# Altium schematic sheet DSO_Trig.SchDoc: Schematic_Name
size A4; CompanyName: University of Melbourne; Engineer: Your Name Here; DocumentNumber: 1; Revision: 0.1; SheetNumber: 1; SheetTotal: 1; Title_Project: Project_Title; StudentNo: Student No.
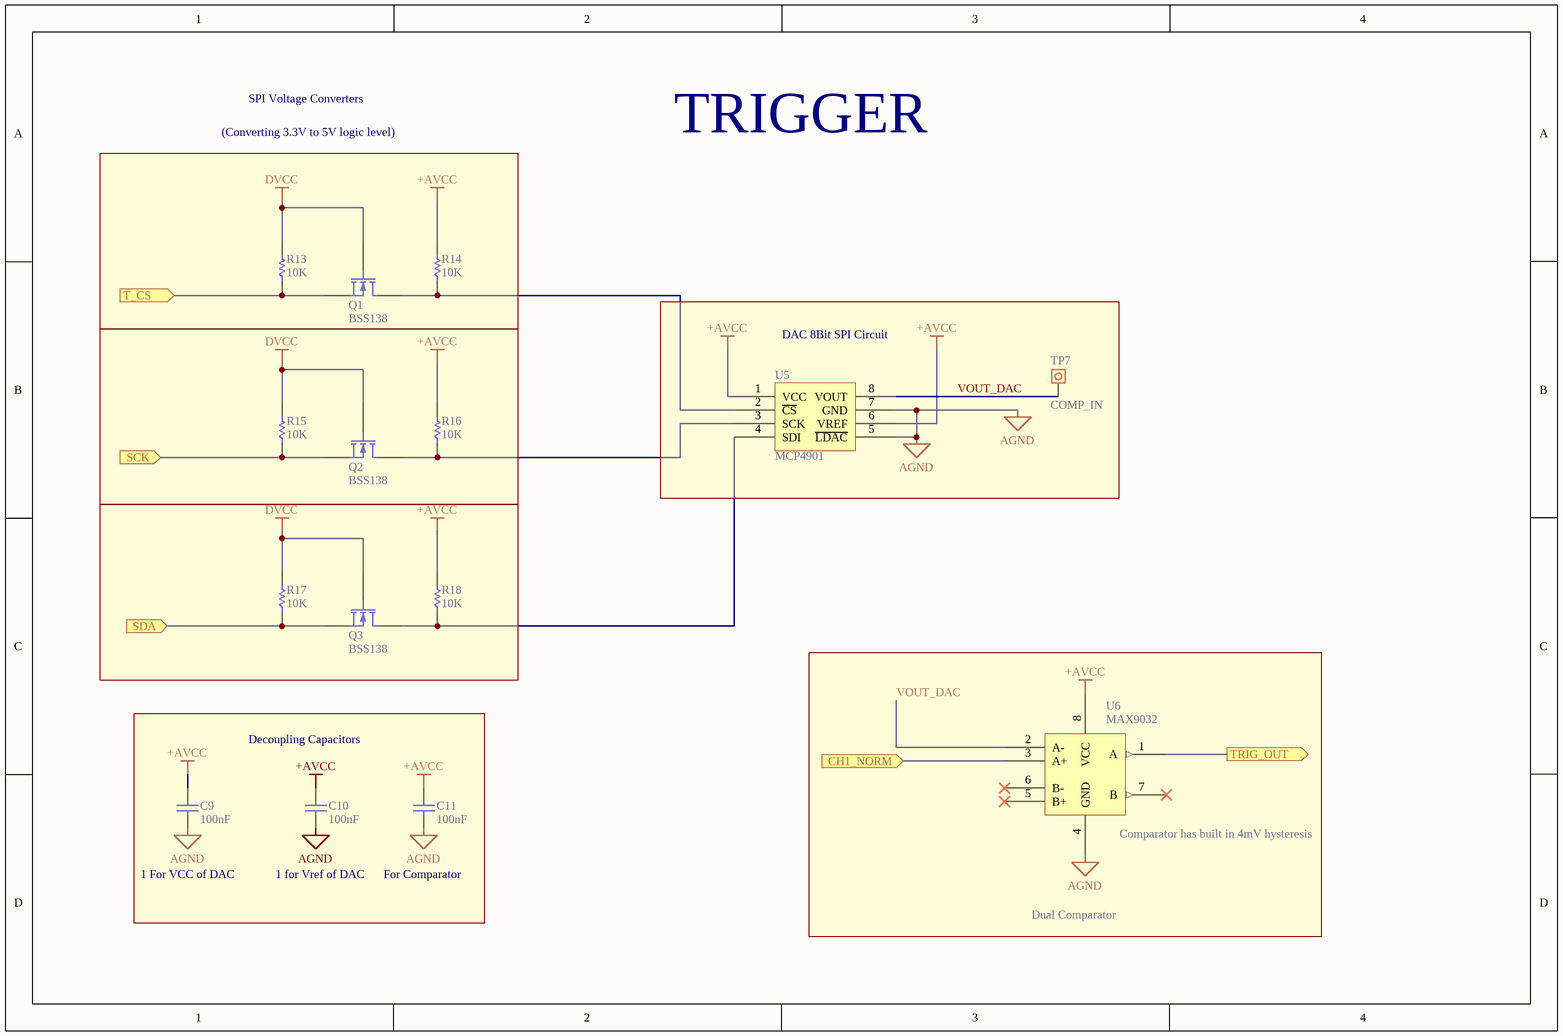
[diagram p0: DSO_Trig.SchDoc]

## Parts
C9  100nF  [0805C]
C10  100nF  [0805C]
C11  100nF  [0805C]
Q1  BSS138  [SOT23]
Q2  BSS138  [SOT23]
Q3  BSS138  [SOT23]
R13  10K  [0805]
R14  10K  [0805]
R15  10K  [0805]
R16  10K  [0805]
R17  10K  [0805]
R18  10K  [0805]
TP7  value COMP_IN  [Testpoin]  (hidden comment: INPUT)
U5  MCP4901  [SOIC-8]
U6  MAX9032  [SOIC-8]

## Blocks framed on the sheet
(Converting 3.3V to 5V logic level): Q1 R13 R14
DAC 8Bit SPI Circuit: TP7 U5

## Ports
CH1_NORM (in), SCK (in), SDA (in), T_CS (in), TRIG_OUT (out)

## Nets
+AVCC: C9.1 C10.1 C11.1 R14.2 R16.2 R18.2 U5.1(VCC) U5.6(VREF) U6.8(VCC)
AGND: C9.2 C10.2 C11.2 U5.5(~{LDAC}) U5.7(GND) U6.4(GND)
DVCC: Q1.1 Q2.1 Q3.1 R13.2 R15.2 R17.2
CH1_NORM: U6.3(A+) ; port CH1_NORM
SCK: Q2.2 R15.1 ; port SCK
SDA: Q3.2 R17.1 ; port SDA
T_CS: Q1.2 R13.1 ; port T_CS
TRIG_OUT: U6.1(A) ; port TRIG_OUT
VOUT_DAC: TP7.1 U5.8(VOUT) U6.2(A-)
NetQ1_3: Q1.3 R14.1 U5.2(~{CS})
NetQ2_3: Q2.3 R16.1 U5.3(SCK)
NetQ3_3: Q3.3 R18.1 U5.4(SDI)

Not connected (* = marked no-connect by the designer): U6 5(B+)* 6(B-)* 7(B)*

## Notes on the sheet
- SPI Voltage Converters
- TRIGGER
- Decoupling Capacitors
- (near U6) Comparator has built in 4mV hysteresis
- 1 For VCC of DAC
- 1 for Vref of DAC
- For Comparator
- Dual Comparator

## Library data of the parts
C9-C11 = C: Capacitor; Reviewed by: RM - 2018/08/05; Revision: July-2002: Re-released for DXP Platform.; Supplier 1: *; Supplier Part Number 1: *; Value: 100nF
Q1-Q3 = MOSFET-N: N-Channel MOSFET; PackageDocument: 1995/1996; Published: 8-Jun-2000; LatestRevisionDate: 17-Jul-2002; LatestRevisionNote: Re-released for DXP Platform.; PackageReference: E3; Publisher: Altium Limited
R13-R18 = R: Resistor; Reviewed by: RM - 2018/08/05; Supplier 1: *; Suppler Part Number 1: *; Value: 10K
TP7 = Test Point: Pad
U5 = MCP4901: DAC 8bit SPI; Reviewed by: RM - 2018/08/05; Supplier 1: Digi-Key; Supplier Part Number 1: MCP4901-E/SN-ND
U6 = MAX9032: Dual Comparator; Reviewed by: RM - 2018/08/05; Supplier 1: Digi-Key; Supplier Part Number 1: MAX9032ASA-ND